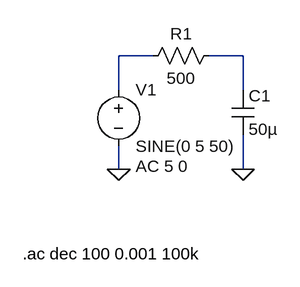
[diagram p0: schematic low pass.asc]
low pass.asc, the LTspice schematic file:
Version 4.1
SHEET 1 880 680
WIRE 176 16 128 16
WIRE 304 16 256 16
WIRE 128 64 128 16
WIRE 304 64 304 16
WIRE 128 176 128 144
WIRE 304 176 304 128
FLAG 304 176 0
FLAG 128 176 0
DATAFLAG 304 48 ""
DATAFLAG 304 48 ""
DATAFLAG 304 48 ""
DATAFLAG 304 48 ""
DATAFLAG 304 48 ""
SYMBOL res 272 0 R90
WINDOW 0 0 56 VBottom 2
WINDOW 3 32 56 VTop 2
SYMATTR InstName R1
SYMATTR Value 500
SYMBOL cap 288 64 R0
SYMATTR InstName C1
SYMATTR Value 50µ
SYMBOL voltage 128 48 R0
WINDOW 123 24 124 Left 2
WINDOW 39 0 0 Left 0
SYMATTR InstName V1
SYMATTR Value SINE(0 5 50)
SYMATTR Value2 AC 5 0
TEXT -8 296 Left 2 !.ac dec 100 0.001 100k

The netlist it stands for:
* low pass.asc
R1 N002 N001 500
C1 N002 0 50µ
V1 N001 0 SINE(0 5 50) AC 5 0
.ac dec 100 0.001 100k
.backanno
.end